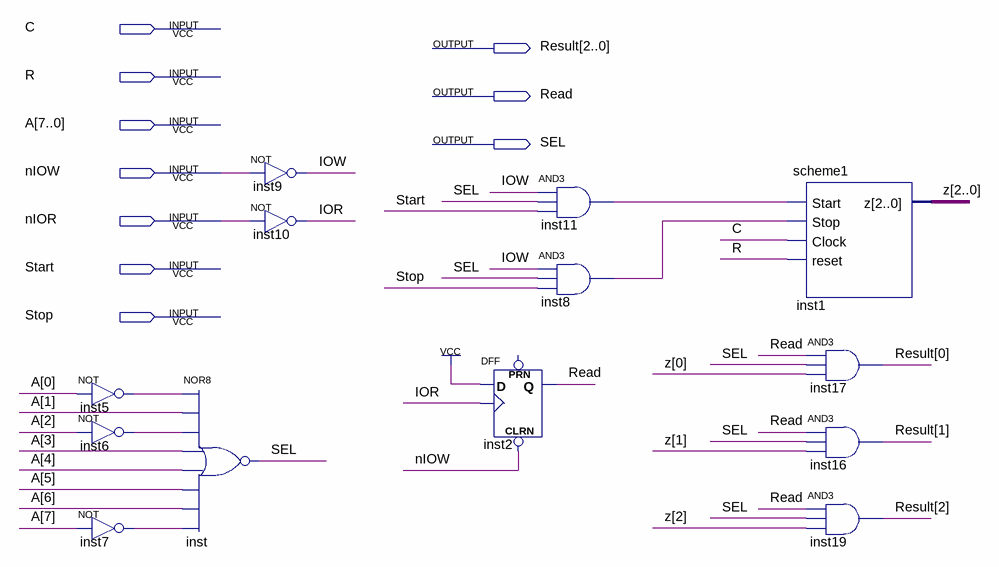
[diagram p0: schematic sheet]
// Quartus schematic int_v1.bdf as structural Verilog: 13 symbols, 10 pins
module int_v1 (
  input  C,
  input  R,
  input  [7:0] A,
  input  nIOW,
  input  nIOR,
  input  Start,
  input  Stop,
  output [2:0] Result,
  output Read,
  output SEL
);

  wire inst5_out, inst6_out, inst7_out, inst8_out, inst11_out, IOR, IOW;
  wire [2:0] z;

  not inst5 (inst5_out, A[0]);
  not inst6 (inst6_out, A[2]);
  not inst7 (inst7_out, A[7]);
  nor inst (SEL, inst5_out, A[1], inst6_out, A[3], A[4], A[5], A[6], inst7_out);
  not inst9 (IOW, nIOW);
  not inst10 (IOR, nIOR);
  DFF inst2 (.CLRN(nIOW), .CLK(IOR), .D(1'b1), .Q(Read));  // open: PRN
  and inst11 (inst11_out, IOW, SEL, Start);
  and inst8 (inst8_out, IOW, SEL, Stop);
  scheme1 inst1 (.Start(inst11_out), .Stop(inst8_out), .Clock(C), .reset(R), .z(z));
  and inst17 (Result[0], Read, SEL, z[0]);
  and inst16 (Result[1], Read, SEL, z[1]);
  and inst19 (Result[2], Read, SEL, z[2]);
endmodule
